# EAGLE design 8051_with_lcd (EAGLE 6.1)
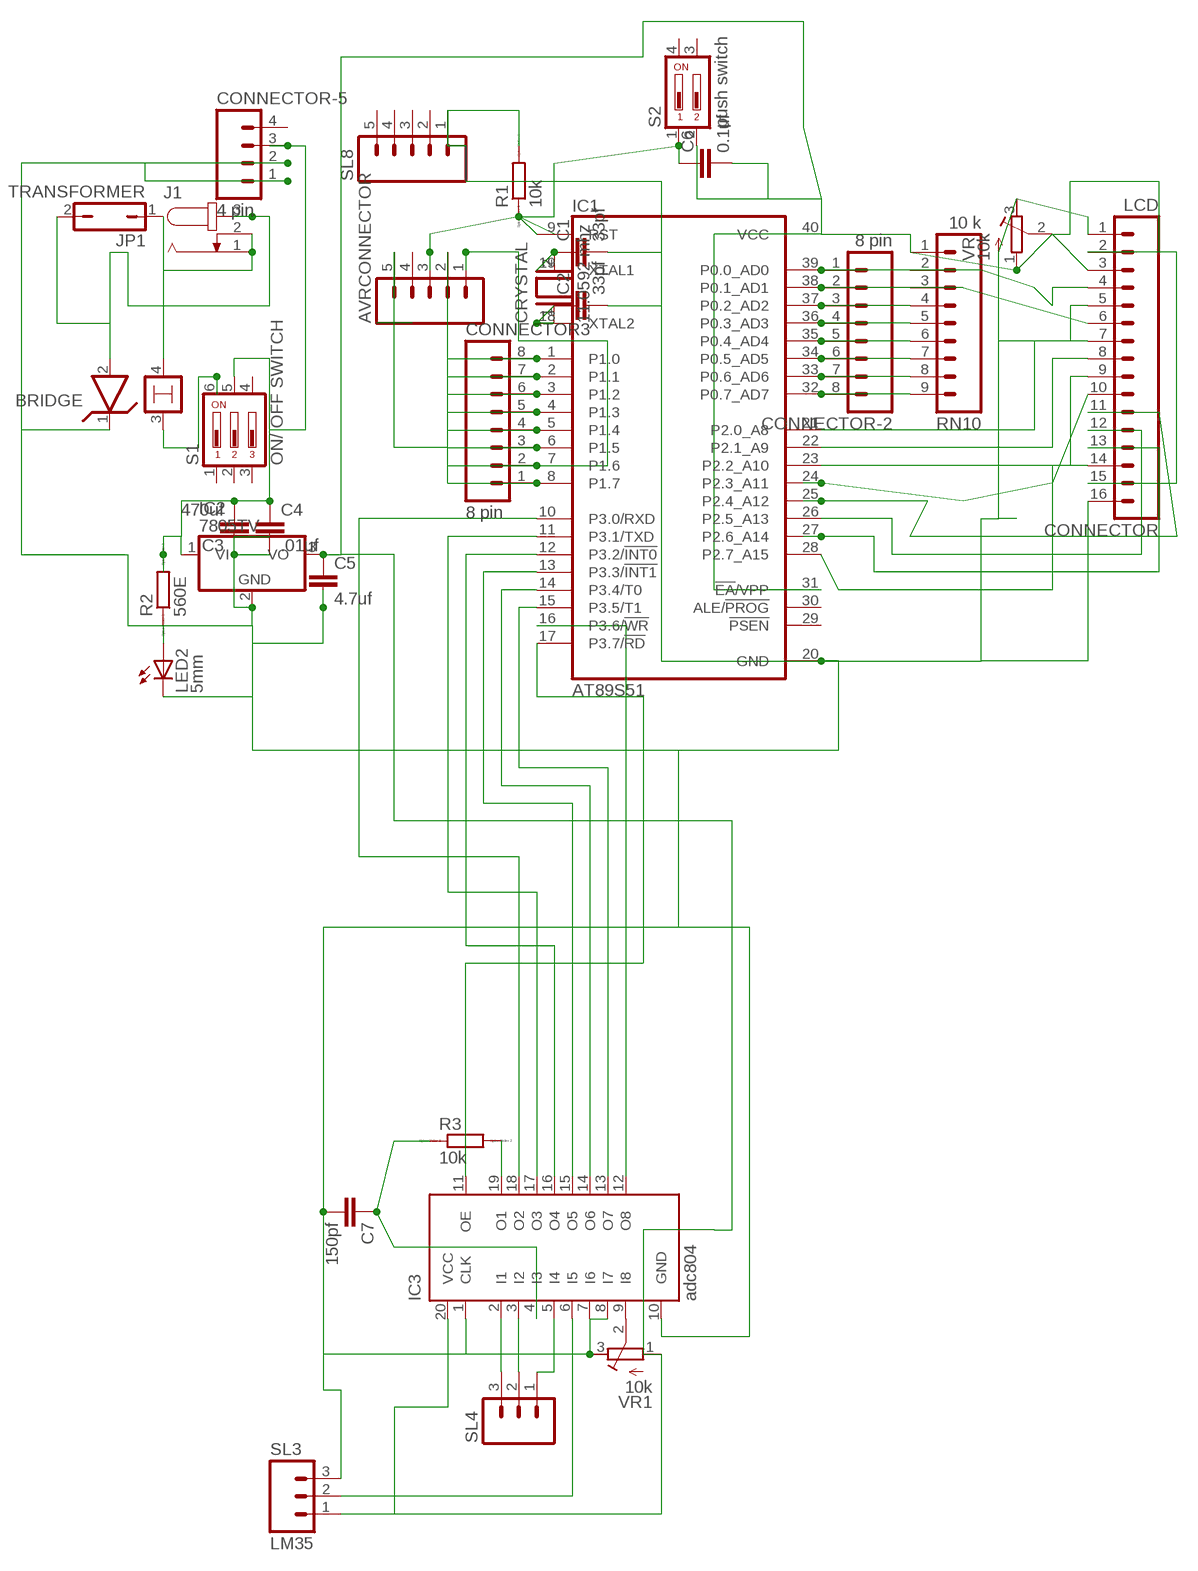
[diagram p0: schematic, sheet 1]

## Parts
AVRCONNECTOR  M05  [05P]
BRIDGE  LM399H  [TO39/4]
C1  33pf  C-EU025-024X044  [C025-024X044]
C2  33pf  C-EU025-024X044  [C025-024X044]
C3  470uf  C5/7.2  [C5B7.2]
C4  .01uf  C2,5-3  [C2.5-3]
C5  4.7uf  C2,5-3  [C2.5-3]
C6  0.1uf  C2.5/6  [C2.5-6]
C7  150pf  C2,5-3  [C2.5-3]
CONNECTOR  LCD  M16  [16P]
CONNECTOR3  8 pin  M08  [08P]
CONNECTOR-2  8 pin  M08  [08P]
CONNECTOR-5  4 pin  M04  [04P]
CRYSTAL  11.0592 mhz  XTAL/S  [QS]
IC1  AT89S51  AT89C51-12PC  [DIL40]
IC2  7805TV  [TO220V]
IC3  adc804  ATF16V8BP3  [DIL20]
J1  JACK-PLUG0  [SPC4077]
JP1  TRANSFORMER  JP1Q  [JP1]
LED2  5mm  LED5MM  [LED5MM]
R1  10k  R0204/7  [0204/7]
R2  560E  R0204/7  [0204/7]
R3  10k  R0204/7  [0204/7]
RN10  10 k  M09  [09P]
S1  ON/ OFF SWITCH  DA03  [DA-03]
S2  push switch  DP02  [DP-02]
SL3  LM35  M03  [03P]
SL4  M03  [03P]
SL8  M05  [05P]
VR  10k  R-TRIMM64P  [RTRIM64P]
VR1  10k  R-TRIMM64P  [RTRIM64P]

## Nets
N$1: C2.1 CRYSTAL.1 IC1.18(XTAL2)
N$2: C1.1 CRYSTAL.2 IC1.19(XTAL1)
N$3: IC1.10(P3.0/RXD) IC3.18(O2)
N$4: C3.2 C4.1 CONNECTOR-5.3 IC2.1(VI) R2.2 S1.5
N$5: BRIDGE.2 J1.3 JP1.2
N$6: BRIDGE.1 C1.2 C2.2 C3.1 C4.2 C5.2 C7.2 CONNECTOR-5.1 CONNECTOR-5.2 CONNECTOR.1 CONNECTOR.5 CONNECTOR.16 IC1.20(GND) IC2.2(GND) IC3.1(CLK) IC3.7(I6) IC3.8(I7) IC3.10(GND) LED2.K(C) R1.2 SL3.3 SL8.1 VR1.3(A) VR.3(A)
N$7: IC1.11(P3.1/TXD) IC3.17(O3)
N$8: IC1.12(P3.2/!INT0) IC3.16(O4)
N$9: IC1.13(P3.3/!INT1) IC3.15(O5)
N$10: IC1.14(P3.4/T0) IC3.14(O6)
N$11: IC1.15(P3.5/T1) IC3.13(O7)
N$12: IC1.16(P3.6/!WR) IC3.12(O8)
N$13: IC1.17(P3.7/!RD) IC3.11(OE)
N$14: AVRCONNECTOR.3 C6.1 IC1.9(RST) R1.1 S2.1
N$15: AVRCONNECTOR.1 CONNECTOR3.2 IC1.7(P1.6)
N$16: BRIDGE.4 J1.1 J1.2 JP1.1
N$17: CONNECTOR3.4 IC1.5(P1.4)
N$18: CONNECTOR3.5 IC1.4(P1.3)
N$19: CONNECTOR3.6 IC1.3(P1.2)
N$20: CONNECTOR3.7 IC1.2(P1.1)
N$21: CONNECTOR3.8 IC1.1(P1.0)
N$22: IC3.19(O1) R3.2
N$23: C7.1 IC3.4(I3) R3.1
N$24: CONNECTOR-2.3 IC1.37(P0.2_AD2) RN10.4
N$25: CONNECTOR-2.4 IC1.36(P0.3_AD3) RN10.5
N$26: CONNECTOR-2.5 IC1.35(P0.4_AD4) RN10.6
N$27: CONNECTOR-2.6 IC1.34(P0.5_AD5) RN10.7
N$28: CONNECTOR-2.7 IC1.33(P0.6_AD6) RN10.8
N$29: CONNECTOR-2.8 IC1.32(P0.7_AD7) RN10.9
N$30: CONNECTOR.7 IC1.21(P2.0_A8)
N$31: CONNECTOR.8 IC1.22(P2.1_A9)
N$32: CONNECTOR.9 IC1.23(P2.2_A10)
N$33: IC3.6(I5) SL3.2
N$34: IC3.2(I1) SL4.3
N$35: CONNECTOR.12 IC1.26(P2.5_A13)
N$36: IC3.3(I2) SL4.2
N$37: IC3.5(I4) SL4.1
N$38: CONNECTOR.3 VR.2(S)
N$40: IC3.9(I8) VR1.2(S)
N$42: AVRCONNECTOR.5 CONNECTOR3.3 IC1.6(P1.5)
N$43: LED2.A R2.1
N$45: AVRCONNECTOR.2 CONNECTOR3.1 IC1.8(P1.7)
N$47: BRIDGE.3 S1.6
N$48: CONNECTOR-2.2 CONNECTOR.6 IC1.38(P0.1_AD1) RN10.3
N$49: C5.1 C6.2 CONNECTOR.2 CONNECTOR.15 IC1.31(!EA!/VPP) IC1.40(VCC) IC2.3(VO) IC3.20(VCC) RN10.1 S2.2 SL3.1 VR1.1(E) VR.1(E)
N$51: CONNECTOR.10 IC1.24(P2.3_A11)
N$52: CONNECTOR.11 IC1.25(P2.4_A12)
N$54: CONNECTOR.13 IC1.27(P2.6_A14)
N$55: CONNECTOR.14 IC1.28(P2.7_A15)
N$58: CONNECTOR-2.1 CONNECTOR.4 IC1.39(P0.0_AD0) RN10.2
Unconnected: AVRCONNECTOR.4 CONNECTOR-5.4 IC1.29(!PSEN) IC1.30(ALE/!PROG) S1.1 S1.2 S1.3 S1.4 S2.3 S2.4 SL8.2 SL8.3 SL8.4 SL8.5

## Library data of the parts
AVRCONNECTOR SL8 = con-amp-quick:M05: AMP QUICK CONNECTOR; OC_FARNELL: unknown; OC_NEWARK: unknown
BRIDGE = linear:LM399H: Precision Z DIODE
C1 C2 = rcl:C-EU: CAPACITOR, European symbol
C3-C7 = capacitor-wima:C: CAPACITOR naming: grid - package width
CONNECTOR = con-amp-quick:M16: AMP QUICK CONNECTOR; OC_FARNELL: unknown; OC_NEWARK: unknown
CONNECTOR3 CONNECTOR-2 = con-amp-quick:M08: AMP QUICK CONNECTOR; OC_FARNELL: unknown; OC_NEWARK: unknown
CONNECTOR-5 = con-amp-quick:M04: AMP QUICK CONNECTOR; OC_FARNELL: unknown; OC_NEWARK: unknown
CRYSTAL = special:XTAL/S: CRYSTAL
IC1 = atmel:AT89C51-*: 8-bit Microcontroller with 4K Bytes Flash Not Recommended for New Designs. Use AT89S51. Source: http://www.atmel.com/dyn/resources/prod_documents/doc0265.; OC_FARNELL: unknown; OC_NEWARK: unknown
IC2 = linear:78*: Positive VOLTAGE REGULATOR Source: http://cache.national.com/ds/LM/LM78L05.pdf http://www.fairchildsemi.com/ds/LM/LM7805.pdf
IC3 = atmel:ATF16V8B: High perfomance CMOS (electrically erasable) programmable logic device (PLD) ABLE-Atmel-ABEL - P18V8R, P16V8C, P16V8AS, P17V8 COPL Atmel-WinCUPL - G16V8MS, G16V8MA, G16V8AS, G16V8 LOG/IC - GAL16V8_R, GAL16V8_G7, GAL16V8_C), GAL16V8 Tango-PLD - G16V8R, G16V8C, G16V8AS, G16V8 Source: http://www.atmel.com/dyn/resources/prod_documents/DOC0364.PDF; MPN: ATF16V8CZ-15PU; OC_FARNELL: 1551768; OC_NEWARK: 94M6254
J1 = con-jack:JACK-PLUG: DC POWER JACK Power Jack, DC, Right Angle, Through Hole, Rated 5A at 16VDC, PC Terminals Distributor: Farnell (www.Farnell.de) Drawing: 84N1161.pdf / 84N1162.pdf Manufacturer: SPC Technology (www.spctechnology.com) Type: SPC4077 / SPC 4078; OC_FARNELL: unknown; OC_NEWARK: unknown
JP1 = jumper:JP1Q: JUMPER
LED2 = led:LED: LED OSRAM: - CHIPLED LG R971, LG N971, LY N971, LG Q971, LY Q971, LO R971, LY R971 LH N974, LH R974 LS Q976, LO Q976, LY Q976 LO Q996 - Hyper CHIPLED LW Q18S LB Q993, LB Q99A, LB R99A - SideLED LS A670, LO A670, LY A670, LG A670, LP A670 LB A673, LV A673, LT A673, LW A673 LH A674 LY A675 LS A676, LA A676, LO A676, LY A676, LW A676 LS A679, LY A679, LG A679 - Hyper Micro SIDELED® LS Y876, LA Y876, LO Y876, LY Y876 LT Y87S - SmartLED LW L88C, LW L88S LB L89C, LB L89S, LG L890 LS L89K, LO L89K, LY L89K LS L896, LA L896, LO L896, LY L896 - TOPLED LS T670, LO T670, LY T670, LG T670, LP T670 LSG T670, LSP T670, LSY T670, LOP T670, LYG T670 LG T671, LOG T671, LSG T671 LB T673, LV T673, LT T673, LW T673 LH T674 LS T676, LA T676, LO T676, LY T676, LB T676, LH T676, LSB T676, LW T676 LB T67C, LV T67C, LT T67C, LS T67K, LO T67K, LY T67K, LW E67C LS E67B, LA E67B, LO E67B, LY E67B, LB E67C, LV E67C, LT E67C LW T67C LS T679, LY T679, LG T679 LS T770, LO T770, LY T770, LG T770, LP T770 LB T773, LV T773, LT T773, LW T773 LH T774 LS E675, LA E675, LY E675, LS T675 LS T776, LA T776, LO T776, LY T776, LB T776 LHGB T686 LT T68C, LB T68C - Hyper Mini TOPLED® LB M676 - Mini TOPLED Santana® LG M470 LS M47K, LO M47K, LY M47K Source: http://www.osram.convergy.de LUXEON: - LUMILED® LXK2-PW12-R00, LXK2-PW12-S00, LXK2-PW14-U00, LXK2-PW14-V00 LXK2-PM12-R00, LXK2-PM12-S00, LXK2-PM14-U00 LXK2-PE12-Q00, LXK2-PE12-R00, LXK2-PE12-S00, LXK2-PE14-T00, LXK2-PE14-U00 LXK2-PB12-K00, LXK2-PB12-L00, LXK2-PB12-M00, LXK2-PB14-N00, LXK2-PB14-P00, LXK2-PB14-Q00 LXK2-PR12-L00, LXK2-PR12-M00, LXK2-PR14-Q00, LXK2-PR14-R00 LXK2-PD12-Q00, LXK2-PD12-R00, LXK2-PD12-S00 LXK2-PH12-R00, LXK2-PH12-S00 LXK2-PL12-P00, LXK2-PL12-Q00, LXK2-PL12-R00 Source: www.luxeon.com KINGBRIGHT: KA-3528ASYC Source: www.kingbright.com
R1-R3 = eagle-ltspice:R: RESISTOR, European symbol; SPICEMODEL: NONE; SPICEPREFIX: R
RN10 = con-amp-quick:M09: AMP QUICK CONNECTOR; OC_FARNELL: unknown; OC_NEWARK: unknown
S1 = switch-dil:DA03: DIL/CODE SWITCH; MPN: MCDA03; OC_FARNELL: 1521999; OC_NEWARK: 74M2972
S2 = switch-dil:DP02: DIL/CODE SWITCH; MPN: MCDP02; OC_FARNELL: 1255233; OC_NEWARK: 26M1095
SL3 SL4 = con-amp-quick:M03: AMP QUICK CONNECTOR; OC_FARNELL: unknown; OC_NEWARK: unknown
VR VR1 = resistor:R-TRIMM: Trimm resistor

## Board
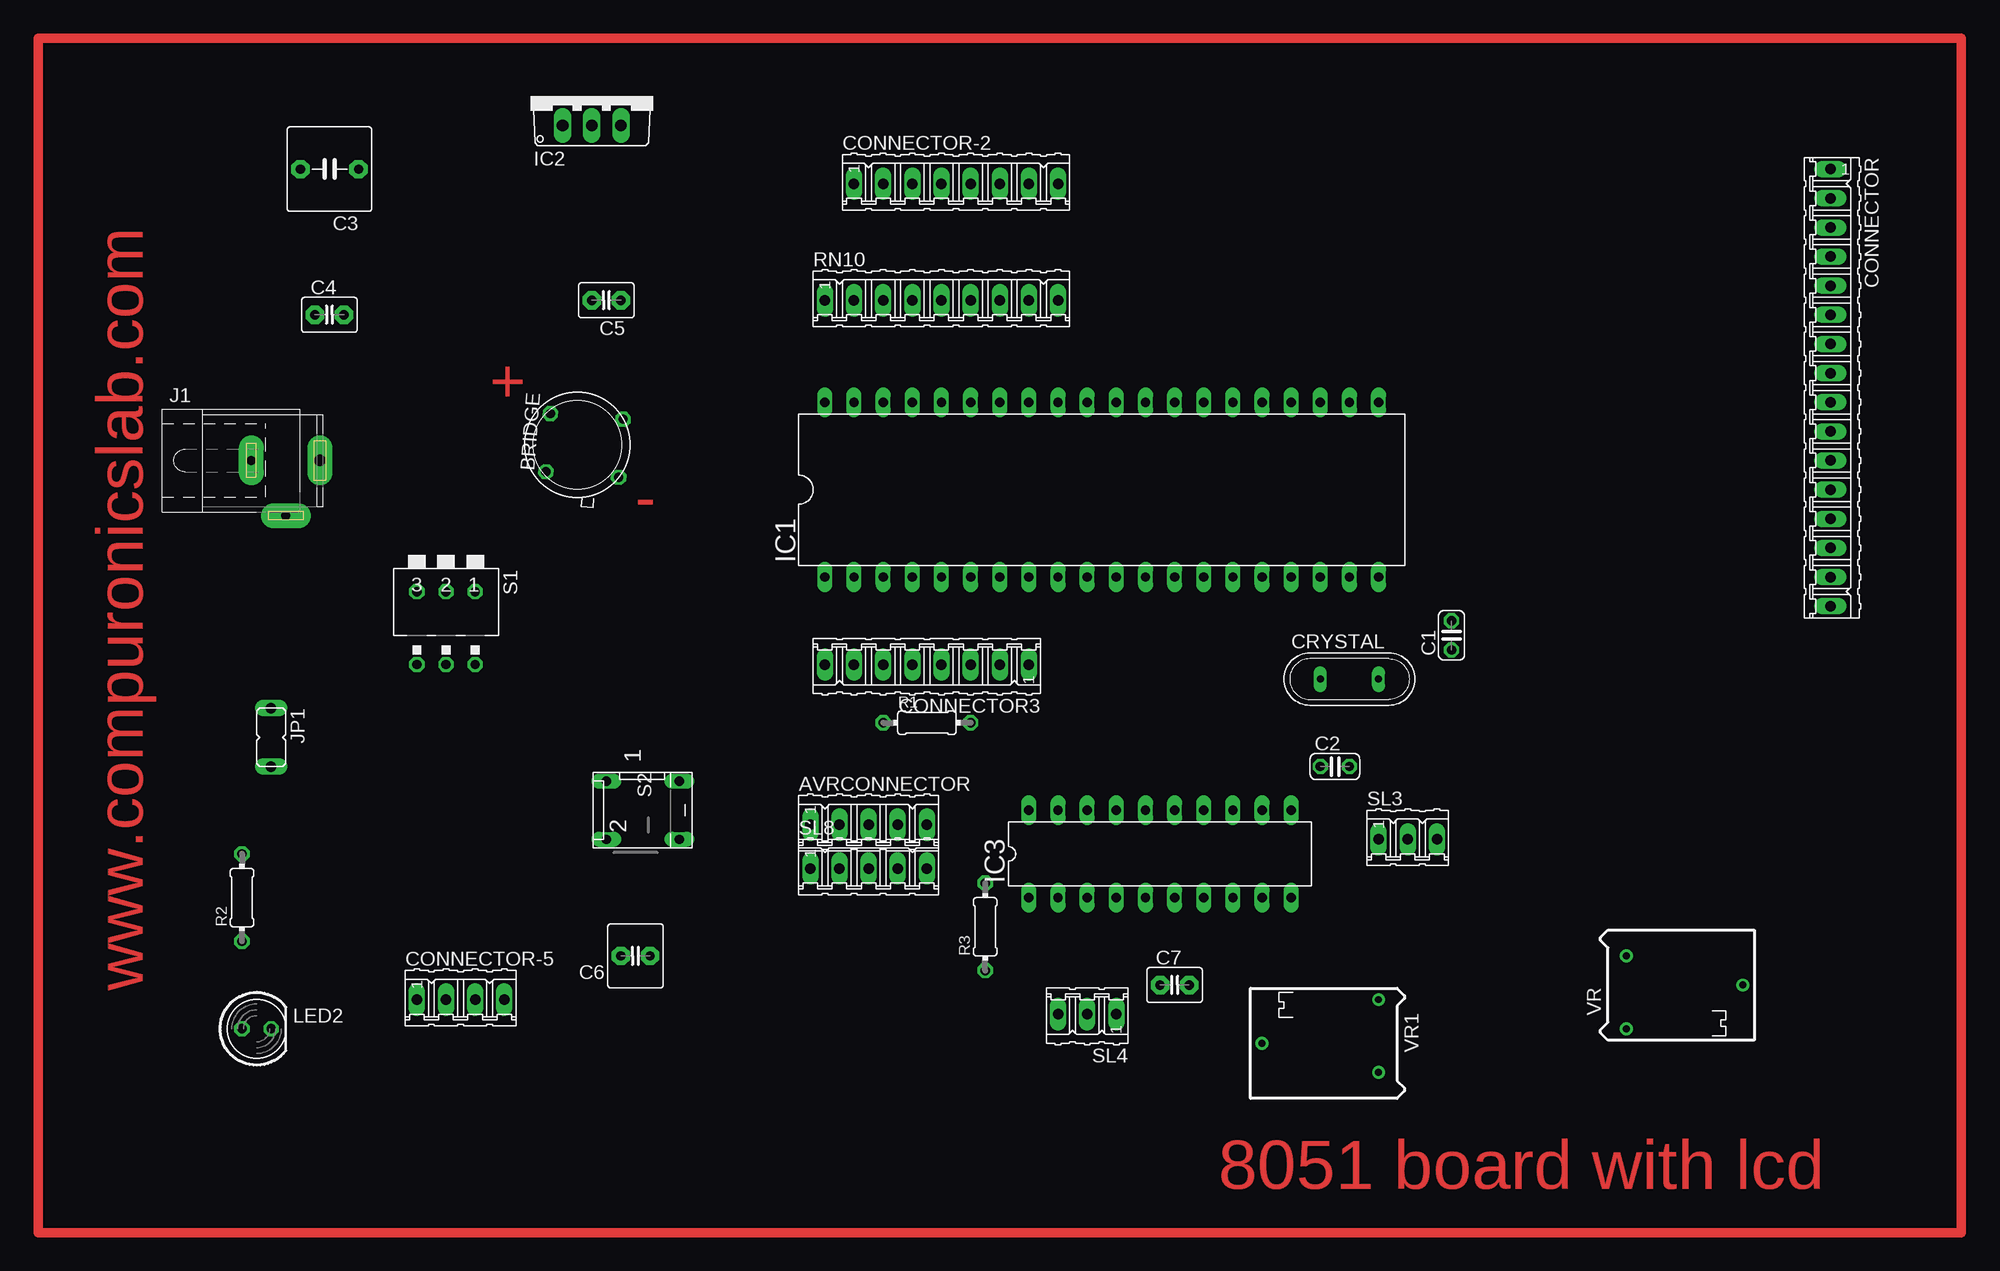
[diagram p1: board, top side]
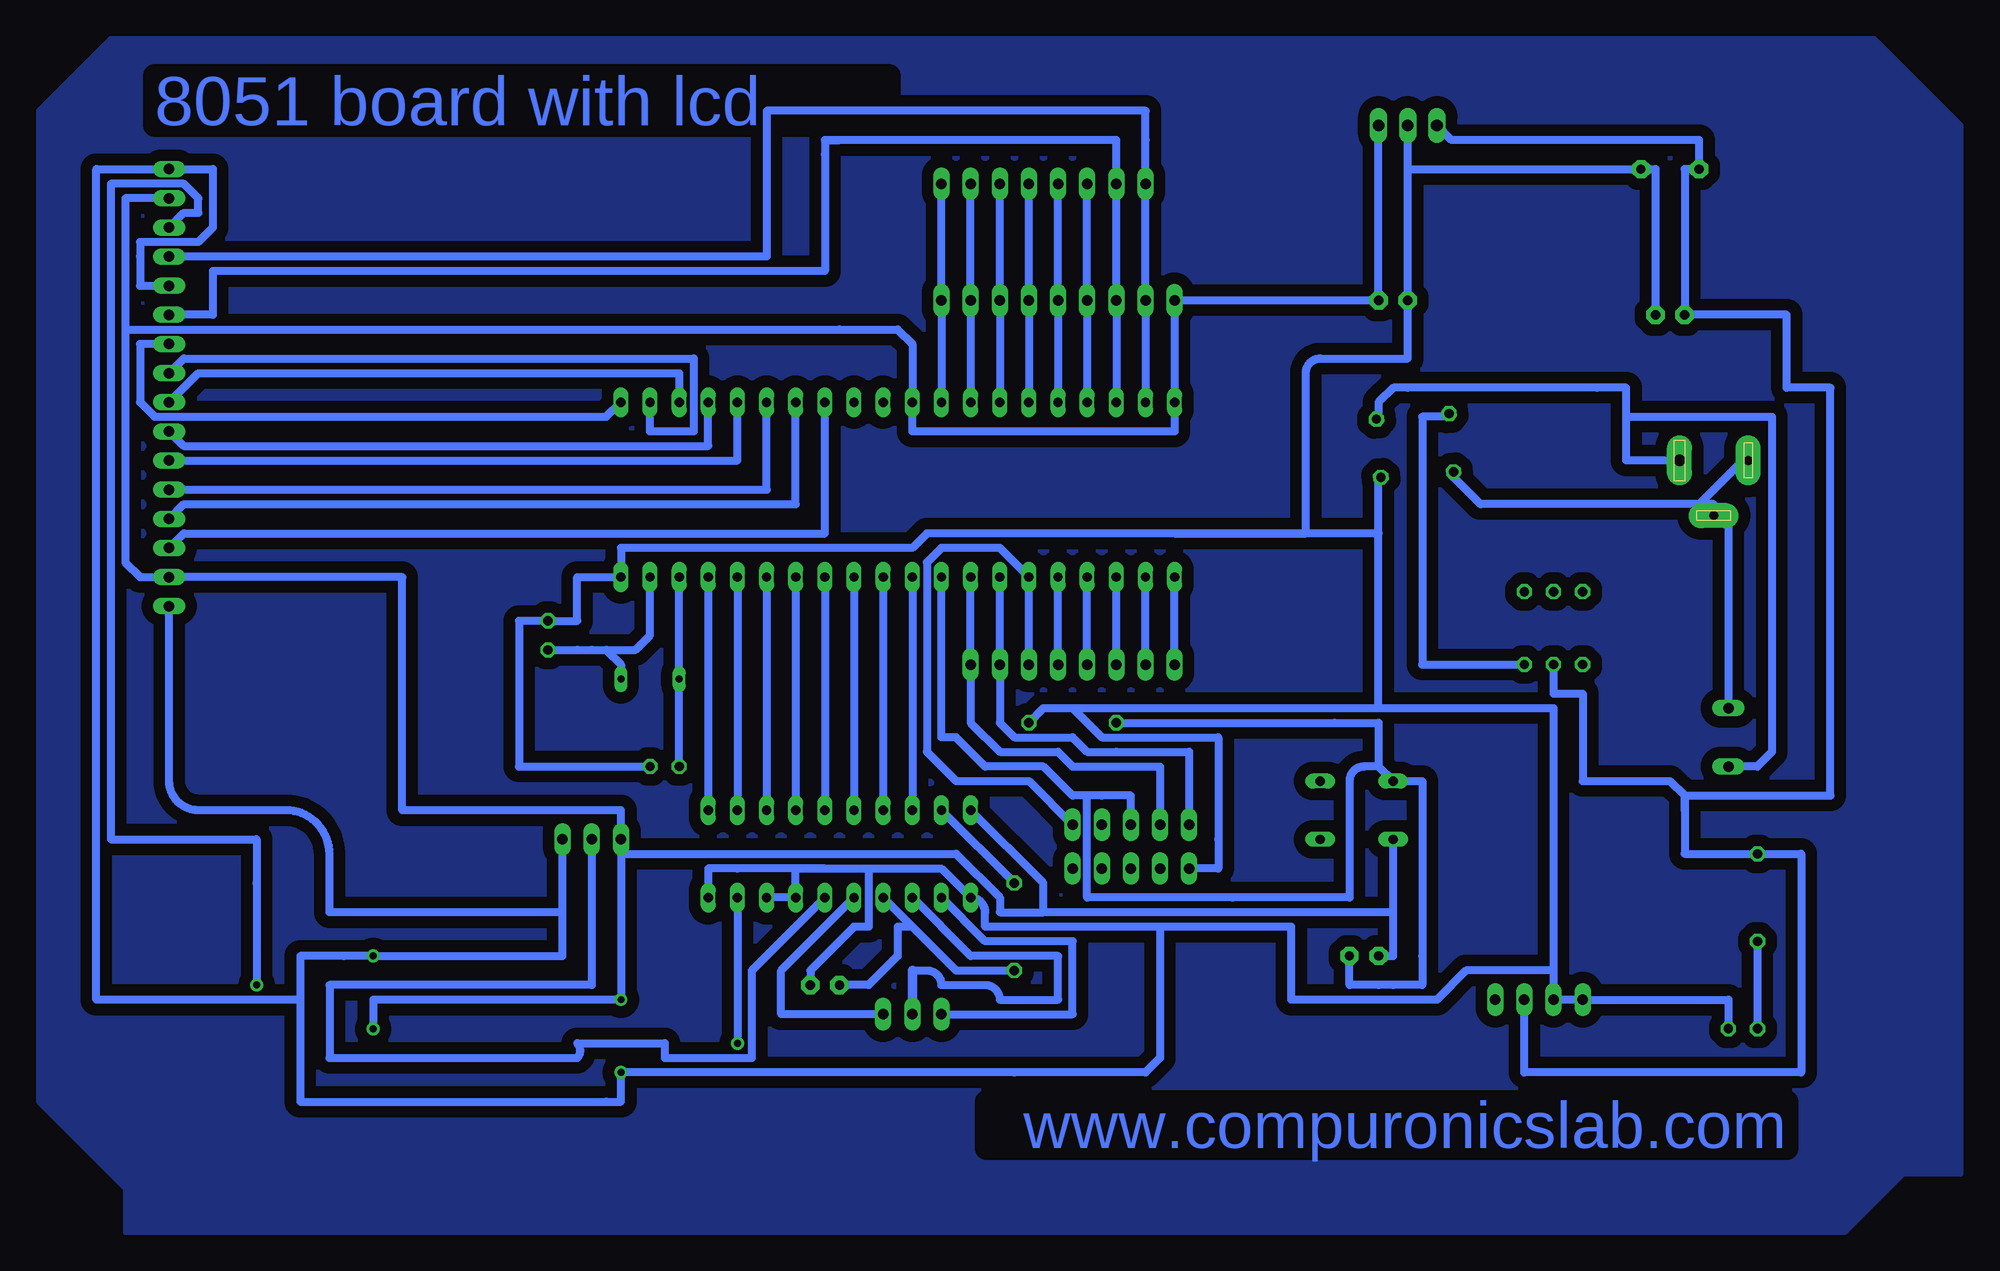
[diagram p2: board, bottom side, seen from below]

No outline drawn. Coordinates in mm, seen from the top.
Copper layers (1*16): Top 0.035mm / dielectric 1.5mm / Bottom 0.035mm
Design rules: minimum track width 28mil, minimum drill 24mil, track to track 20mil, track to pad 8mil, pad to pad 8mil, via to via 8mil, smd to smd 8mil, copper to edge 20mil, drill to drill 8mil, minimum pad ring 10mil, minimum via ring 8mil, stop-mask expansion 8mil, vias tented up to drill 0mil, thermal gap 20mil

### Footprints (pad centres in the part's own frame; a part is rotated, then mirrored left to right if it is on the bottom)
05P = drill 0.914 long: 1 -5.08,0; 2 -2.54,0; 3 0,0; 4 2.54,0; 5 5.08,0
TO39/4 = drill 0.813 octagon: 1 -2.54,-2.54; 2 2.54,-2.54; 3 2.54,3.81; 4 -2.54,3.81
C025-024X044 = drill 0.813 octagon: 1 -1.27,0; 2 1.27,0
C5B7.2 = drill 0.813 pad 1.6 octagon: 1 -2.54,0; 2 2.54,0
C2.5-3 = drill 0.813 pad 1.6 octagon: 1 -1.27,0; 2 1.27,0
C2.5-6 = drill 0.813 pad 1.6 octagon: 1 -1.27,0; 2 1.27,0
16P = drill 0.914 long: 1 -19.05,0; 2 -16.51,0; 3 -13.97,0; 4 -11.43,0; 5 -8.89,0; 6 -6.35,0; 7 -3.81,0; 8 -1.27,0; 9 1.27,0; 10 3.81,0; 11 6.35,0; 12 8.89,0; 13 11.43,0; 14 13.97,0; 15 16.51,0; 16 19.05,0
08P = drill 0.914 long: 1 -8.89,0; 2 -6.35,0; 3 -3.81,0; 4 -1.27,0; 5 1.27,0; 6 3.81,0; 7 6.35,0; 8 8.89,0
04P = drill 0.914 long: 1 -3.81,0; 2 -1.27,0; 3 1.27,0; 4 3.81,0
QS = drill 0.61 long: 1 -2.54,0; 2 2.54,0
DIL40 = drill 0.813 long: 1 -24.13,-7.62; 2 -21.59,-7.62; 3 -19.05,-7.62; 4 -16.51,-7.62; 5 -13.97,-7.62; 6 -11.43,-7.62; 7 -8.89,-7.62; 8 -6.35,-7.62; 9 -3.81,-7.62; 10 -1.27,-7.62; 11 1.27,-7.62; 12 3.81,-7.62; 13 6.35,-7.62; 14 8.89,-7.62; 15 11.43,-7.62; 16 13.97,-7.62; 17 16.51,-7.62; 18 19.05,-7.62; 19 21.59,-7.62; 20 24.13,-7.62; 21 24.13,7.62; 22 21.59,7.62; 23 19.05,7.62; 24 16.51,7.62; 25 13.97,7.62; 26 11.43,7.62; 27 8.89,7.62; 28 6.35,7.62; 29 3.81,7.62; 30 1.27,7.62; 31 -1.27,7.62; 32 -3.81,7.62; 33 -6.35,7.62; 34 -8.89,7.62; 35 -11.43,7.62; 36 -13.97,7.62; 37 -16.51,7.62; 38 -19.05,7.62; 39 -21.59,7.62; 40 -24.13,7.62
TO220V = drill 1.016 long: 1 -2.54,-2.54; 2 0,-2.54; 3 2.54,-2.54
DIL20 = drill 0.813 long: 1 -11.43,-3.81; 2 -8.89,-3.81; 3 -6.35,-3.81; 4 -3.81,-3.81; 5 -1.27,-3.81; 6 1.27,-3.81; 7 3.81,-3.81; 8 6.35,-3.81; 9 8.89,-3.81; 10 11.43,-3.81; 11 11.43,3.81; 12 8.89,3.81; 13 6.35,3.81; 14 3.81,3.81; 15 1.27,3.81; 16 -1.27,3.81; 17 -3.81,3.81; 18 -6.35,3.81; 19 -8.89,3.81; 20 -11.43,3.81
SPC4077 = drill 0.8 pad 2.184 long: 1 -3,0; 2 0,-4.8 | drill 1 pad 2.184 long: 3 3,0
JP1 = drill 0.914 long: 1 0,-2.54; 2 0,2.54
LED5MM = drill 0.813 octagon: A -1.27,0; K 1.27,0
0204/7 = drill 0.813 octagon: 1 -3.81,0; 2 3.81,0
09P = drill 0.914 long: 1 -10.16,0; 2 -7.62,0; 3 -5.08,0; 4 -2.54,0; 5 0,0; 6 2.54,0; 7 5.08,0; 8 7.62,0; 9 10.16,0
DA-03 = drill 0.813 octagon: 1 -2.54,-5.08; 2 0,-5.08; 3 2.54,-5.08; 4 2.54,1.27; 5 0,1.27; 6 -2.54,1.27
DP-02 = drill 0.813 long: 1 -2.54,-2.54; 2 2.54,-2.54; 3 2.54,3.81; 4 -2.54,3.81
03P = drill 0.914 long: 1 -2.54,0; 2 0,0; 3 2.54,0
RTRIM64P = drill 0.61: 1 -2.54,-3.81; 2 7.62,0; 3 -2.54,2.54

### Placement (x,y rotation side)
AVRCONNECTOR  33.02,16.51 0 top
BRIDGE  8.89,49.53 85.6 top
C1  83.82,33.02 90 top
C2  73.66,21.59 0 top
C3  -13.97,73.66 180 top
C4  -13.97,60.96 0 top
C5  10.16,62.23 180 top
C6  12.7,5.08 180 top
C7  59.69,2.54 0 top
CONNECTOR  116.84,54.61 270 top
CONNECTOR3  38.1,30.48 180 top
CONNECTOR-2  40.64,72.39 0 top
CONNECTOR-5  -2.54,1.27 0 top
CRYSTAL  74.93,29.21 0 top
IC1  53.34,45.72 0 top
IC2  8.89,80.01 0 top
IC3  58.42,13.97 0 top
J1  -17.78,48.26 0 top
JP1  -19.05,24.13 180 top
LED2  -20.32,-1.27 0 top
R1  38.1,25.4 0 top
R2  -21.59,10.16 90 top
R3  43.18,7.62 90 top
RN10  39.37,62.23 0 top
S1  -3.81,31.75 180 top
S2  12.7,17.78 270 top
SL3  80.01,15.24 0 top
SL4  52.07,0 180 top
SL8  33.02,12.7 0 top
VR  101.6,2.54 0 top
VR1  74.93,-2.54 180 top

### Tracks (layer width: path | path; a pad name or v marks a point on that pad's centre or on a via)
N$1
  Bottom 0.711: C2.1 CRYSTAL.1 IC1.18
N$2
  Bottom 0.711: CRYSTAL.2 77.47,30.48 78.74,31.75 80.01,31.75 81.28,31.75 | C1.1 81.28,31.75 | 81.28,31.75 76.2,31.75 74.93,33.02 IC1.19
N$3
  Bottom 0.711: IC1.10 IC3.18
N$4
  Bottom 0.711: IC2.1 5.08,76.2 -13.97,76.2 -16.51,76.2 C3.2 -15.24,73.66 C4.1 -24.13,60.96 -24.13,54.61 -27.94,54.61 -27.94,19.05 -15.24,19.05 | -15.24,19.05 -13.97,20.32 -6.35,20.32 -6.35,27.94 -3.81,27.94 S1.5 | -15.24,19.05 -15.24,17.78 | -15.24,17.78 -15.24,13.97 R2.2 -25.4,13.97 -25.4,-5.08 -1.27,-5.08 CONNECTOR-5.3 | -15.24,17.78 -15.24,19.05
N$5
  Bottom 0.711: -10.16,52.07 -10.16,48.26 -13.97,48.26 J1.3 | -10.16,52.07 -10.16,54.61 -7.62,54.61 8.89,54.61 10.16,54.61 11.43,53.34 11.43,52.07 BRIDGE.2 | JP1.2 -21.59,21.59 -22.86,22.86 -22.86,25.4 -22.86,52.07 -10.16,52.07
N$6
  Bottom 0.711: CONNECTOR.5 119.38,63.5 119.38,66.04 119.38,67.31 114.3,67.31 113.03,68.58 113.03,73.66 CONNECTOR.1 123.19,73.66 123.19,1.27 105.41,1.27 | 105.41,1.27 105.41,5.08 101.6,5.08 VR.3 86.36,5.08 82.55,5.08 82.55,8.89 | 105.41,1.27 105.41,-6.35 105.41,-7.62 78.74,-7.62 77.47,-7.62 VR1.3 43.18,-5.08 31.75,-5.08 30.48,-3.81 30.48,7.62 | 82.55,8.89 SL3.3 | CONNECTOR.16 116.84,20.32 arc-90 114.3,17.78 106.68,17.78 arc90 102.87,13.97 102.87,8.89 90.17,8.89 82.55,8.89 | C4.2 -12.7,73.66 C3.1 8.89,73.66 | 8.89,73.66 C5.2 8.89,57.15 16.51,57.15 arc-90 17.78,55.88 17.78,41.91 29.21,41.91 | 8.89,73.66 IC2.2 | 59.69,12.7 55.88,12.7 | 55.88,12.7 49.53,12.7 IC3.1 arc90 45.72,8.89 45.72,7.62 44.45,7.62 30.48,7.62 | 59.69,12.7 62.23,12.7 IC3.7 IC3.8 | IC3.10 69.85,12.7 67.31,12.7 59.69,12.7 | C7.2 60.96,3.81 59.69,5.08 57.15,7.62 55.88,7.62 55.88,12.7 | C2.2 85.09,21.59 86.36,21.59 86.36,34.29 85.09,34.29 C1.2 81.28,34.29 81.28,38.1 IC1.20 77.47,40.64 74.93,40.64 52.07,40.64 50.8,41.91 29.21,41.91 | LED2.K -19.05,1.27 CONNECTOR-5.1 CONNECTOR-5.2 -3.81,3.81 | 11.43,26.67 11.43,41.91 | 11.43,41.91 11.43,46.99 BRIDGE.1 | 38.1,26.67 40.64,26.67 R1.2 | 38.1,26.67 11.43,26.67 | SL8.1 25.4,12.7 25.4,15.24 25.4,24.13 35.56,24.13 38.1,26.67 | -3.81,3.81 -3.81,26.67 11.43,26.67 | 11.43,41.91 29.21,41.91 | 30.48,7.62 19.05,7.62 19.05,1.27 12.7,1.27 6.35,1.27 3.81,3.81 -3.81,3.81
N$7
  Bottom 0.711: IC1.11 IC3.17
N$8
  Bottom 0.711: IC1.12 IC3.16
N$9
  Bottom 0.711: IC1.13 IC3.15
N$10
  Bottom 0.711: IC1.14 IC3.14
N$11
  Bottom 0.711: IC1.15 IC3.13
N$12
  Bottom 0.711: IC1.16 IC3.12
N$13
  Bottom 0.711: IC1.17 IC3.11
N$14
  Bottom 0.711: IC1.9 49.53,24.13 48.26,24.13 45.72,21.59 40.64,21.59 38.1,19.05 36.83,19.05 | 36.83,19.05 35.56,19.05 33.02,19.05 AVRCONNECTOR.3 | 11.43,21.59 11.43,25.4 15.24,25.4 R1.1 | 11.43,21.59 S2.1 7.62,20.32 7.62,5.08 7.62,2.54 10.16,2.54 11.43,2.54 13.97,2.54 C6.1 | 36.83,19.05 36.83,10.16 24.13,10.16 13.97,10.16 13.97,20.32 arc90 12.7,21.59 11.43,21.59
N$15
  Bottom 0.711: IC1.7 CONNECTOR3.2 44.45,25.4 43.18,24.13 38.1,24.13 36.83,22.86 34.29,22.86 27.94,22.86 AVRCONNECTOR.1
N$16
  Bottom 0.711: -16.51,44.45 -17.78,44.45 J1.2 | -16.51,44.45 2.54,44.45 5.08,46.99 BRIDGE.4 | JP1.1 -19.05,43.18 -17.78,43.18 J1.2 | -16.51,44.45 -20.32,48.26 J1.1 | -16.51,44.45 J1.2
N$17
  Bottom 0.711: CONNECTOR3.4 IC1.5
N$18
  Bottom 0.711: CONNECTOR3.5 IC1.4
N$19
  Bottom 0.711: CONNECTOR3.6 IC1.3
N$20
  Bottom 0.711: CONNECTOR3.7 IC1.2
N$21
  Bottom 0.711: CONNECTOR3.8 IC1.1
N$22
  Bottom 0.711: IC3.19 R3.2
N$23
  Bottom 0.711: R3.1 48.26,3.81 52.07,7.62 | IC3.4 52.07,7.62 | C7.1 55.88,2.54 53.34,5.08 53.34,7.62 52.07,7.62
N$24
  Bottom 0.711: IC1.37 RN10.4 CONNECTOR-2.3
N$25
  Bottom 0.711: IC1.36 RN10.5 CONNECTOR-2.4
N$26
  Bottom 0.711: IC1.35 RN10.6 CONNECTOR-2.5
N$27
  Bottom 0.711: IC1.34 RN10.7 CONNECTOR-2.6
N$28
  Bottom 0.711: IC1.33 RN10.8 CONNECTOR-2.7
N$29
  Bottom 0.711: IC1.32 RN10.9 CONNECTOR-2.8
N$30
  Bottom 0.711: IC1.21 78.74,52.07 118.11,52.07 119.38,53.34 119.38,58.42 CONNECTOR.7
N$31
  Bottom 0.711: IC1.22 74.93,50.8 72.39,50.8 71.12,50.8 71.12,52.07 71.12,57.15 115.57,57.15 CONNECTOR.8
N$32
  Bottom 0.711: IC1.23 72.39,55.88 74.93,55.88 114.3,55.88 CONNECTOR.9
N$33
  Bottom 0.711: IC3.6 66.04,3.81 66.04,-3.81 73.66,-3.81 73.66,-2.54 81.28,-2.54 arc90 81.28,-3.81 95.25,-3.81 102.87,-3.81 102.87,2.54 80.01,2.54 80.01,3.81 SL3.2
N$34
  Bottom 0.711: IC3.2 45.72,6.35 38.1,6.35 38.1,0 SL4.3
N$35
  Bottom 0.711: IC1.26 64.77,45.72 CONNECTOR.12
N$36
  Bottom 0.711: IC3.3 46.99,5.08 39.37,5.08 39.37,1.27 44.45,1.27 arc-90 45.72,2.54 49.53,2.54 arc-90 50.8,3.81 52.07,3.81 | SL4.2 52.07,1.27 52.07,2.54
  Bottom 0.813: 52.07,3.81 52.07,1.27
N$37
  Bottom 0.711: IC3.5 63.5,3.81 63.5,0 SL4.1
N$38
  Bottom 0.711: VR.2 109.22,11.43 109.22,15.24 121.92,15.24 121.92,38.1 121.92,72.39 115.57,72.39 114.3,71.12 114.3,69.85 115.57,69.85 CONNECTOR.3
N$39
  Top 0.813: -39.37,85.09 128.27,85.09 128.27,-19.05 -39.37,-19.05 -39.37,78.74 | -39.37,78.74 -39.37,85.09 | -39.37,85.09 -39.37,78.74 | -39.37,78.74 -39.37,85.09
N$40
  Bottom 0.711: IC3.9 VR1.2
N$41
  pour Bottom (isolate 1.016): -29.21,-19.05 -34.29,-13.97 -39.37,-13.97 -39.37,77.47 -31.75,85.09 121.92,85.09 128.27,78.74 128.27,73.66 128.27,-7.62 120.65,-15.24 120.65,-19.05
N$42
  Bottom 0.711: CONNECTOR3.3 IC1.6 44.45,40.64 49.53,40.64 50.8,39.37 50.8,22.86 48.26,20.32 41.91,20.32 AVRCONNECTOR.5
N$43
  Bottom 0.711: R2.1 LED2.A
N$45
  Bottom 0.711: IC1.8 CONNECTOR3.1 46.99,25.4 44.45,22.86 39.37,22.86 38.1,21.59 35.56,21.59 30.48,21.59 AVRCONNECTOR.2
N$47
  Bottom 0.711: S1.6 7.62,30.48 7.62,52.07 5.08,52.07 BRIDGE.3
N$48
  Bottom 0.711: IC1.38 RN10.3 CONNECTOR-2.2 34.29,76.2 59.69,76.2 | CONNECTOR.6 113.03,60.96 113.03,64.77 59.69,64.77 59.69,74.93 59.69,76.2 | 59.69,76.2 58.42,76.2
N$49
  Bottom 0.711: IC2.3 C5.1 RN10.1 IC1.40 29.21,50.8 31.75,50.8 49.53,50.8 52.07,50.8 IC1.31 52.07,58.42 53.34,59.69 58.42,59.69 120.65,59.69 | 10.16,8.89 10.16,5.08 C6.2 | 10.16,8.89 S2.2 | 40.64,8.89 38.1,8.89 10.16,8.89 | 40.64,8.89 40.64,11.43 | 40.64,11.43 IC3.20 | 120.65,59.69 120.65,71.12 CONNECTOR.2 | 120.65,59.69 120.65,41.91 120.65,39.37 119.38,38.1 CONNECTOR.15 96.52,38.1 96.52,17.78 80.01,17.78 77.47,17.78 SL3.1 | SL3.1 77.47,13.97 | 77.47,13.97 VR1.1 78.74,1.27 99.06,1.27 VR.1 | 40.64,8.89 40.64,10.16 40.64,11.43 | 40.64,8.89 44.45,8.89 44.45,10.16 48.26,13.97 77.47,13.97 | 77.47,13.97 SL3.1
N$51
  Bottom 0.711: IC1.24 69.85,49.53 115.57,49.53 CONNECTOR.10
N$52
  Bottom 0.711: IC1.25 67.31,48.26 CONNECTOR.11
N$54
  Bottom 0.711: IC1.27 62.23,44.45 115.57,44.45 CONNECTOR.13
N$55
  Bottom 0.711: IC1.28 59.69,41.91 115.57,41.91 CONNECTOR.14
N$58
  Bottom 0.711: IC1.39 RN10.2 CONNECTOR-2.1 31.75,76.2 31.75,78.74 64.77,78.74 64.77,76.2 64.77,66.04 CONNECTOR.4

### Text on the board
Top: www.compuronicslab.com | + | - | 8051 board with lcd
Bottom: 8051 board with lcd | www.compuronicslab.com